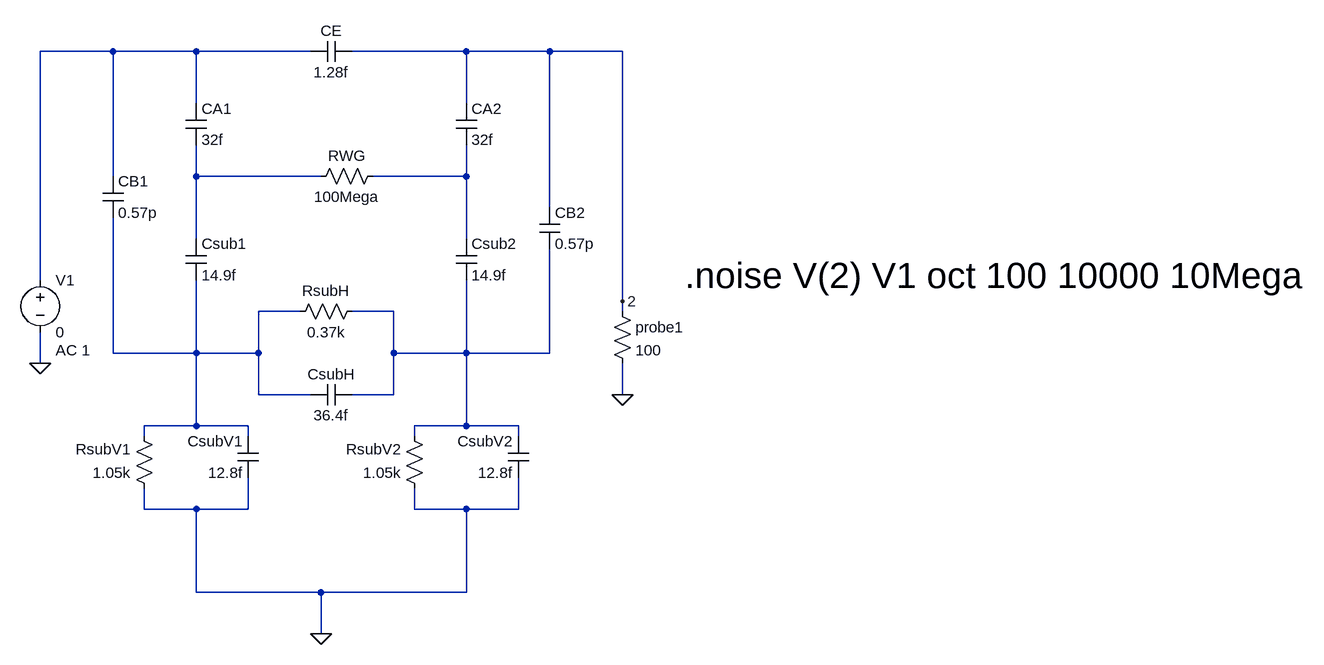
[diagram p0: schematic CLIPP_thermal_noise.asc]
CLIPP_thermal_noise.asc, the LTspice schematic file:
Version 4
SHEET 1 34416 9044
WIRE 15376 2240 15264 2240
WIRE 15504 2240 15376 2240
WIRE 15680 2240 15504 2240
WIRE 15920 2240 15744 2240
WIRE 16048 2240 15920 2240
WIRE 16160 2240 16048 2240
WIRE 15504 2320 15504 2240
WIRE 15920 2320 15920 2240
WIRE 15376 2432 15376 2240
WIRE 15504 2432 15504 2384
WIRE 15696 2432 15504 2432
WIRE 15920 2432 15920 2384
WIRE 15920 2432 15776 2432
WIRE 16048 2480 16048 2240
WIRE 15504 2528 15504 2432
WIRE 15920 2528 15920 2432
WIRE 15264 2592 15264 2240
WIRE 16160 2624 16160 2240
WIRE 15664 2640 15600 2640
WIRE 15808 2640 15744 2640
WIRE 16160 2640 16160 2624
WIRE 15376 2704 15376 2496
WIRE 15504 2704 15504 2592
WIRE 15504 2704 15376 2704
WIRE 15600 2704 15600 2640
WIRE 15600 2704 15504 2704
WIRE 15808 2704 15808 2640
WIRE 15920 2704 15920 2592
WIRE 15920 2704 15808 2704
WIRE 16048 2704 16048 2544
WIRE 16048 2704 15920 2704
WIRE 15264 2720 15264 2672
WIRE 15600 2768 15600 2704
WIRE 15680 2768 15600 2768
WIRE 15808 2768 15808 2704
WIRE 15808 2768 15744 2768
WIRE 16160 2768 16160 2720
WIRE 15504 2816 15504 2704
WIRE 15504 2816 15424 2816
WIRE 15584 2816 15504 2816
WIRE 15920 2816 15920 2704
WIRE 15920 2816 15840 2816
WIRE 16000 2816 15920 2816
WIRE 15424 2832 15424 2816
WIRE 15584 2832 15584 2816
WIRE 15840 2832 15840 2816
WIRE 16000 2832 16000 2816
WIRE 15424 2944 15424 2912
WIRE 15504 2944 15424 2944
WIRE 15584 2944 15584 2896
WIRE 15584 2944 15504 2944
WIRE 15840 2944 15840 2912
WIRE 15920 2944 15840 2944
WIRE 16000 2944 16000 2896
WIRE 16000 2944 15920 2944
WIRE 15504 3072 15504 2944
WIRE 15696 3072 15504 3072
WIRE 15920 3072 15920 2944
WIRE 15920 3072 15696 3072
WIRE 15696 3136 15696 3072
FLAG 15696 3136 0
FLAG 15264 2720 0
FLAG 16160 2768 0
FLAG 16160 2624 2
SYMBOL voltage 15264 2576 R0
WINDOW 123 24 124 Left 2
WINDOW 39 0 0 Left 2
SYMATTR Value2 AC 1
SYMATTR InstName V1
SYMATTR Value 0
SYMBOL cap 15488 2320 R0
SYMATTR InstName CA1
SYMATTR Value 32f
SYMBOL cap 15904 2320 R0
SYMATTR InstName CA2
SYMATTR Value 32f
SYMBOL res 15792 2416 R90
WINDOW 0 0 56 VBottom 2
WINDOW 3 32 56 VTop 2
SYMATTR InstName RWG
SYMATTR Value 100Mega
SYMBOL cap 15360 2432 R0
SYMATTR InstName CB1
SYMATTR Value 0.57p
SYMBOL cap 16032 2480 R0
SYMATTR InstName CB2
SYMATTR Value 0.57p
SYMBOL cap 15488 2528 R0
SYMATTR InstName Csub1
SYMATTR Value 14.9f
SYMBOL cap 15904 2528 R0
SYMATTR InstName Csub2
SYMATTR Value 14.9f
SYMBOL res 15440 2928 R180
WINDOW 0 36 76 Left 2
WINDOW 3 36 40 Left 2
SYMATTR InstName RsubV1
SYMATTR Value 1.05k
SYMBOL res 15760 2624 R90
WINDOW 0 0 56 VBottom 2
WINDOW 3 32 56 VTop 2
SYMATTR InstName RsubH
SYMATTR Value 0.37k
SYMBOL res 16144 2624 R0
SYMATTR InstName probe1
SYMATTR Value 100
SYMBOL cap 15744 2752 R90
WINDOW 0 0 32 VBottom 2
WINDOW 3 32 32 VTop 2
SYMATTR InstName CsubH
SYMATTR Value 36.4f
SYMBOL cap 15600 2896 R180
WINDOW 0 24 56 Left 2
WINDOW 3 24 8 Left 2
SYMATTR InstName CsubV1
SYMATTR Value 12.8f
SYMBOL res 15856 2928 R180
WINDOW 0 36 76 Left 2
WINDOW 3 36 40 Left 2
SYMATTR InstName RsubV2
SYMATTR Value 1.05k
SYMBOL cap 16016 2896 R180
WINDOW 0 24 56 Left 2
WINDOW 3 24 8 Left 2
SYMATTR InstName CsubV2
SYMATTR Value 12.8f
SYMBOL cap 15744 2224 R90
WINDOW 0 0 32 VBottom 2
WINDOW 3 32 32 VTop 2
SYMATTR InstName CE
SYMATTR Value 1.28f
TEXT 16256 2584 Left 5 !.noise V(2) V1 oct 100 10000 10Mega

The netlist it stands for:
* CLIPP_thermal_noise.asc
V1 N001 0 0 AC 1
CA1 N001 N002 32f
CA2 2 N003 32f
RWG N003 N002 100Mega
CB1 N001 N004 0.57p
CB2 2 N005 0.57p
Csub1 N002 N004 14.9f
Csub2 N003 N005 14.9f
RsubV1 0 N004 1.05k
RsubH N005 N004 0.37k
R§probe1 2 0 100
CsubH N005 N004 36.4f
CsubV1 0 N004 12.8f
RsubV2 0 N005 1.05k
CsubV2 0 N005 12.8f
CE 2 N001 1.28f
.noise V(2) V1 oct 100 10000 10Mega
.backanno
.end